# EAGLE design B105X (EAGLE 6.6.0)
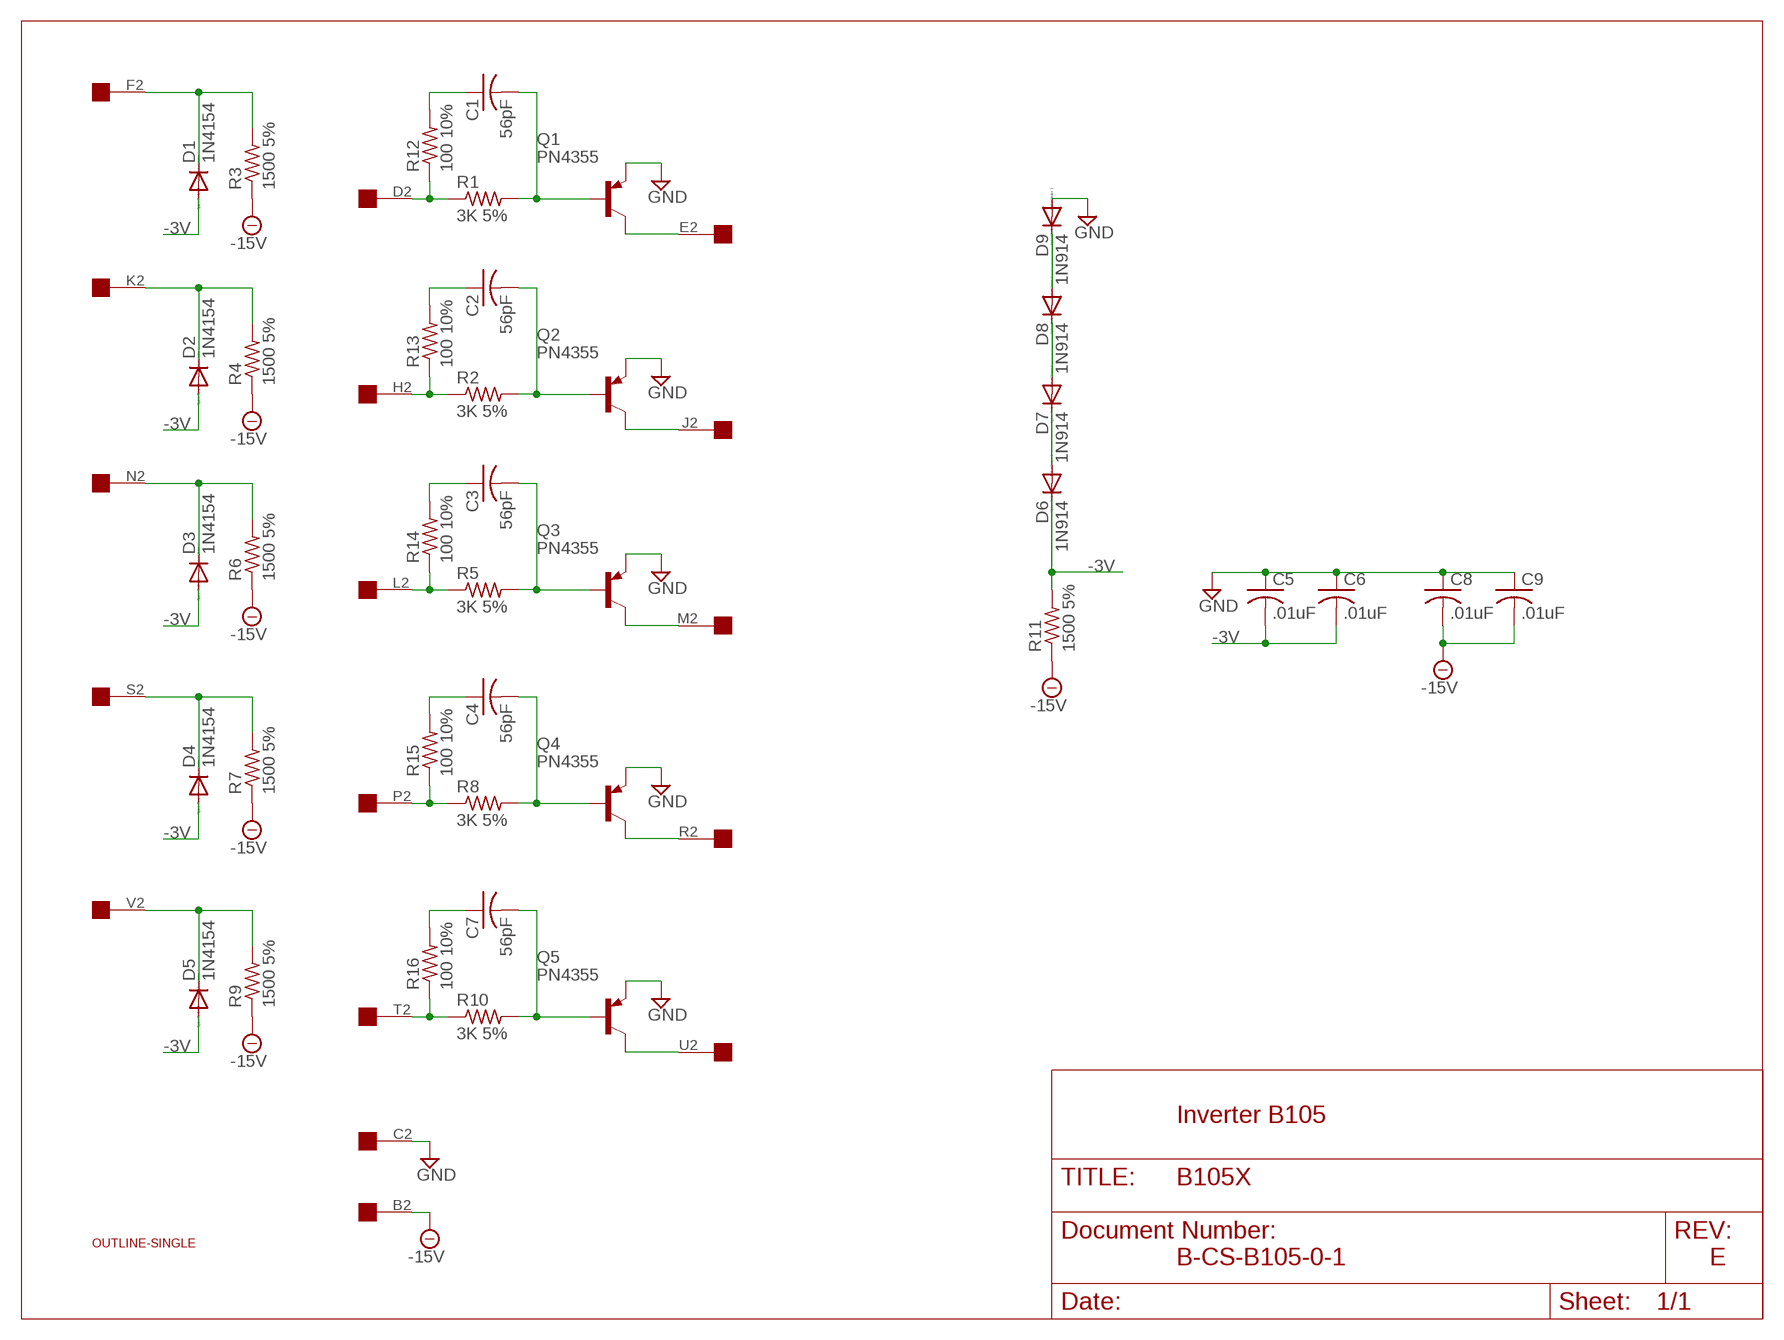
[diagram p0: schematic, sheet 1]

## Parts
C1  56pF  C-US102-043X133  [C102-043X133]
C2  56pF  C-US102-043X133  [C102-043X133]
C3  56pF  C-US102-043X133  [C102-043X133]
C4  56pF  C-US102-043X133  [C102-043X133]
C5  .01uF  C-US102-043X133  [C102-043X133]
C6  .01uF  C-US102-043X133  [C102-043X133]
C7  56pF  C-US102-043X133  [C102-043X133]
C8  .01uF  C-US102-043X133  [C102-043X133]
C9  .01uF  C-US102-043X133  [C102-043X133]
D1  1N4154  1N4148DO35-10  [DO35-10]
D2  1N4154  1N4148DO35-10  [DO35-10]
D3  1N4154  1N4148DO35-10  [DO35-10]
D4  1N4154  1N4148DO35-10  [DO35-10]
D5  1N4154  1N4148DO35-10  [DO35-10]
D6  1N914  1N4148DO35-10  [DO35-10]
D7  1N914  1N4148DO35-10  [DO35-10]
D8  1N914  1N4148DO35-10  [DO35-10]
D9  1N914  1N4148DO35-10  [DO35-10]
Q1  PN4355  2N2904  [TO39]
Q2  PN4355  2N2904  [TO39]
Q3  PN4355  2N2904  [TO39]
Q4  PN4355  2N2904  [TO39]
Q5  PN4355  2N2904  [TO39]
R1  3K 5%  R-US_0207/10  [0207/10]
R2  3K 5%  R-US_0207/10  [0207/10]
R3  1500 5%  R-US_0207/10  [0207/10]
R4  1500 5%  R-US_0207/10  [0207/10]
R5  3K 5%  R-US_0207/10  [0207/10]
R6  1500 5%  R-US_0207/10  [0207/10]
R7  1500 5%  R-US_0207/10  [0207/10]
R8  3K 5%  R-US_0207/10  [0207/10]
R9  1500 5%  R-US_0207/10  [0207/10]
R10  3K 5%  R-US_0207/10  [0207/10]
R11  1500 5%  R-US_0207/10  [0207/10]
R12  100 10%  R-US_0207/10  [0207/10]
R13  100 10%  R-US_0207/10  [0207/10]
R14  100 10%  R-US_0207/10  [0207/10]
R15  100 10%  R-US_0207/10  [0207/10]
R16  100 10%  R-US_0207/10  [0207/10]
U$1  OUTLINE-SINGLE  [SINGLE]
U$2  EDGE-1  [EDGE-CON1]

## Nets
-3V [Supply]: C5.2 C6.2 D1.A D2.A D3.A D4.A D5.A D6.C R11.2
-15V: C8.2 C9.2 R3.1 R4.1 R6.1 R7.1 R9.1 R11.1 U$2.B2
GND [Supply]: C5.1 C6.1 C8.1 C9.1 D9.A Q1.1(E) Q2.1(E) Q3.1(E) Q4.1(E) Q5.1(E) U$2.C2
N$1: R1.1 R12.1 U$2.D2
N$2: C1.1 R12.2
N$3: C1.2 Q1.2(B) R1.2
N$4: Q1.3(C) U$2.E2
N$5: D1.C R3.2 U$2.F2
N$6: R2.1 R13.1 U$2.H2
N$7: C2.1 R13.2
N$8: C2.2 Q2.2(B) R2.2
N$9: Q2.3(C) U$2.J2
N$10: D2.C R4.2 U$2.K2
N$11: R5.1 R14.1 U$2.L2
N$12: C3.1 R14.2
N$13: C3.2 Q3.2(B) R5.2
N$14: Q3.3(C) U$2.M2
N$15: D3.C R6.2 U$2.N2
N$16: R8.1 R15.1 U$2.P2
N$17: C4.1 R15.2
N$18: C4.2 Q4.2(B) R8.2
N$19: Q4.3(C) U$2.R2
N$20: D4.C R7.2 U$2.S2
N$21: R10.1 R16.1 U$2.T2
N$22: C7.1 R16.2
N$23: C7.2 Q5.2(B) R10.2
N$24: Q5.3(C) U$2.U2
N$25: D5.C R9.2 U$2.V2
N$26: D8.A D9.C
N$27: D7.A D8.C
N$29: D6.A D7.C
Unconnected: U$2.A2

## Notes on the sheet
- Inverter B105
- B-CS-B105-0-1 | E

## Library data of the parts
C1-C9 = rcl:C-US: CAPACITOR, American symbol
D1-D9 = diode:1N4148: DIODE high speed (Philips)
Q1-Q5 = transistor-pnp:2N2904*: PNP Transistror
R1-R16 = rcl:R-US_: RESISTOR, American symbol
U$1 = dec-con:OUTLINE-*: Board outlines for DEC boards.
U$2 = dec-con:EDGE-1: Single-Sided DEC Edge Connector -- (side 2)

## Net classes
1 Supply: width 0.813 mm

## Board
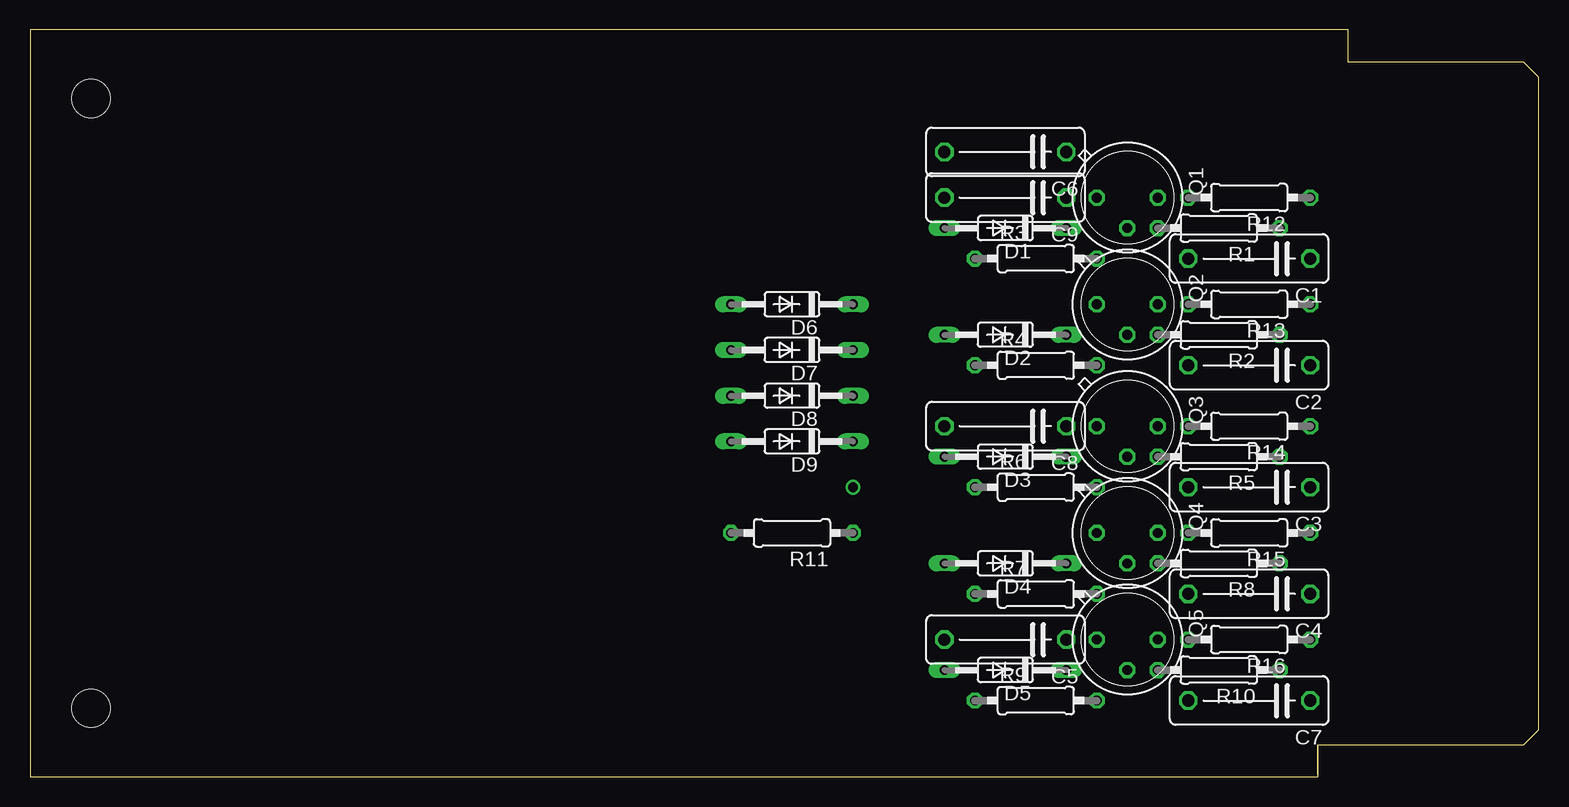
[diagram p1: board, top side]
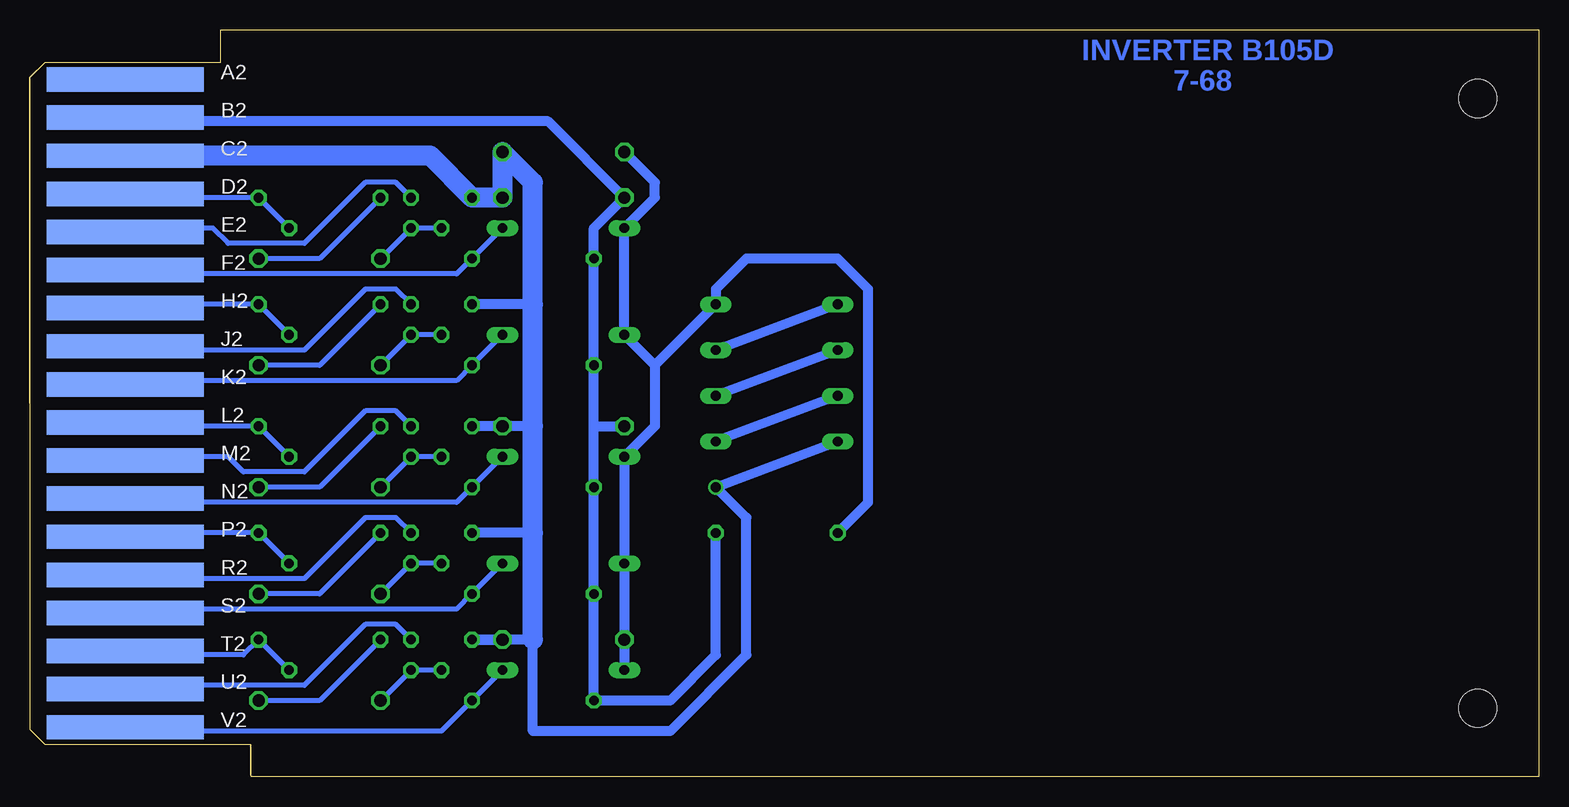
[diagram p2: board, bottom side, seen from below]

Size 125.73 x 62.23 mm. Coordinates in mm from the lower left corner, seen from the top.
Copper layers (1+16): Top 0.035mm / dielectric 1.5mm / Bottom 0.035mm
Design rules "16mils": minimum track width 16mil, minimum drill 32mil, track to track 15mil, track to pad 10mil, pad to pad 10mil, via to via 10mil, smd to smd 10mil, copper to edge 13mil, drill to drill 10mil, minimum pad ring 10mil, minimum via ring 8mil, stop-mask expansion 0mil, vias tented up to drill 0mil, thermal gap 10mil

### Footprints (pad centres in the part's own frame; a part is rotated, then mirrored left to right if it is on the bottom)
C102-043X133 = drill 1.016 octagon: 1 -5.08,0; 2 5.08,0
DO35-10 = drill 0.813 long: A 5.08,0; C -5.08,0
TO39 = drill 0.813 octagon: 1 0,-2.54; 2 2.54,0; 3 0,2.54
0207/10 = drill 0.813 octagon: 1 -5.08,0; 2 5.08,0
SINGLE = hole 3.175: 120.65,56.515; 120.65,5.715
EDGE-CON1 = smd 13.106 x 2.032 bottom: A2 7.938,4.128; B2 7.938,7.303; C2 7.938,10.477; D2 7.938,13.652; E2 7.938,16.828; F2 7.938,20.003; H2 7.938,23.177; J2 7.938,26.352; K2 7.938,29.527; L2 7.938,32.703; M2 7.938,35.877; N2 7.938,39.053; P2 7.938,42.227; R2 7.938,45.403; S2 7.938,48.578; T2 7.938,51.752; U2 7.938,54.928; V2 7.938,58.102

### Placement (x,y rotation side)
C1  101.6,43.18 180 top
C2  101.6,34.29 180 top
C3  101.6,24.13 180 top
C4  101.6,15.24 180 top
C5  81.28,11.43 180 top
C6  81.28,52.07 180 top
C7  101.6,6.35 180 top
C8  81.28,29.21 180 top
C9  81.28,48.26 180 top
D1  81.28,45.72 180 top
D2  81.28,36.83 180 top
D3  81.28,26.67 180 top
D4  81.28,17.78 180 top
D5  81.28,8.89 180 top
D6  63.5,39.37 180 top
D7  63.5,35.56 180 top
D8  63.5,31.75 180 top
D9  63.5,27.94 180 top
Q1  91.44,48.26 270 top
Q2  91.44,39.37 270 top
Q3  91.44,29.21 270 top
Q4  91.44,20.32 270 top
Q5  91.44,11.43 270 top
R1  99.06,45.72 180 top
R2  99.06,36.83 180 top
R3  83.82,43.18 0 top
R4  83.82,34.29 0 top
R5  99.06,26.67 180 top
R6  83.82,24.13 0 top
R7  83.82,15.24 0 top
R8  99.06,17.78 180 top
R9  83.82,6.35 0 top
R10  99.06,8.89 180 top
R11  63.5,20.32 180 top
R12  101.6,48.26 180 top
R13  101.6,39.37 180 top
R14  101.6,29.21 180 top
R15  101.6,20.32 180 top
R16  101.6,11.43 180 top
U$1  125.73,62.23 180 top
U$2  125.73,62.23 180 top

### Tracks (layer width: path | path; a pad name or v marks a point on that pad's centre or on a via)
-3V
  Bottom 0.813: D5.A C5.2 D4.A D3.A 73.66,29.21 73.66,34.29 | R11.2 55.88,22.86 55.88,40.64 58.42,43.18 66.04,43.18 68.58,40.64 D6.C 73.66,34.29 | C6.2 73.66,49.53 73.66,48.26 D1.A D2.A 73.66,34.29
-15V
  Bottom 0.813: 78.74,29.21 R6.1 R7.1 R9.1 72.39,6.35 68.58,10.16 R11.1 | 78.74,29.21 R4.1 R3.1 78.74,45.72 C9.2 82.55,54.61 116.84,54.61 U$2.B2 | 78.74,29.21 C8.2
GND  (via drill 0.81)
  Bottom 0.813: C5.1 Q5.1 83.82,11.43 83.82,3.81 72.39,3.81 66.04,10.16 66.04,21.59 v68.58,24.13 D9.A | 83.82,39.37 Q2.1 | Q3.1 C8.1 83.82,29.21 | 83.82,20.32 Q4.1
  Bottom 1.676: 83.82,11.43 83.82,20.32 83.82,29.21 83.82,39.37 83.82,49.53 C6.1 C9.1 Q1.1 92.39,51.75 117.16,51.75 U$2.C2
N$1
  Bottom 0.406: U$2.D2 117.14,48.56 116.84,48.26 R12.1 R1.1
N$2
  Bottom 0.406: C1.1 101.6,43.18 R12.2
N$3
  Bottom 0.406: C1.2 R1.2 Q1.2
N$4
  Bottom 0.406: U$2.E2 116.84,45.72 110.49,45.72 109.22,44.45 102.87,44.45 97.79,49.53 95.25,49.53 Q1.3
N$5
  Bottom 0.406: D1.C R3.2 90.17,41.91 116.84,41.91 U$2.F2
N$6
  Bottom 0.406: U$2.H2 117.17,39.04 116.84,39.37 R13.1 R2.1
N$7
  Bottom 0.406: C2.1 101.6,34.29 R13.2
N$8
  Bottom 0.406: C2.2 R2.2 Q2.2
N$9
  Bottom 0.406: U$2.J2 116.84,35.56 102.87,35.56 97.79,40.64 95.25,40.64 Q2.3
N$10
  Bottom 0.406: D2.C R4.2 90.17,33.02 116.84,33.02 U$2.K2
N$11
  Bottom 0.406: U$2.L2 117.17,29.54 116.84,29.21 R14.1 R5.1
N$12
  Bottom 0.406: C3.1 101.6,24.13 R14.2
N$13
  Bottom 0.406: C3.2 R5.2 Q3.2
N$14
  Bottom 0.406: U$2.M2 116.84,26.67 109.22,26.67 107.95,25.4 102.87,25.4 97.79,30.48 95.25,30.48 Q3.3
N$15
  Bottom 0.406: D3.C R6.2 90.17,22.86 116.84,22.86 U$2.N2
N$16
  Bottom 0.406: U$2.P2 116.84,20.32 R15.1 R8.1
N$17
  Bottom 0.406: C4.1 101.6,15.24 R15.2
N$18
  Bottom 0.406: C4.2 R8.2 Q4.2
N$19
  Bottom 0.406: U$2.R2 116.84,16.51 102.87,16.51 97.79,21.59 95.25,21.59 Q4.3
N$20
  Bottom 0.406: D4.C R7.2 90.17,13.97 116.84,13.97 U$2.S2
N$21
  Bottom 0.406: U$2.T2 116.84,10.16 107.95,10.16 R16.1 R10.1
N$22
  Bottom 0.406: C7.1 101.6,6.35 R16.2
N$23
  Bottom 0.406: Q5.2 R10.2 C7.2
N$24
  Bottom 0.406: U$2.U2 116.84,7.62 102.87,7.62 97.79,12.7 95.25,12.7 Q5.3
N$25
  Bottom 0.406: U$2.V2 116.84,4.13 116.84,3.81 91.44,3.81 R9.2 D5.C
N$26
  Bottom 0.813: D8.A D9.C
N$27
  Bottom 0.813: D7.A D8.C
N$29
  Bottom 0.813: D6.A D7.C

### Text on the board
Bottom: INVERTER B105D | 7-68